# EAGLE schematic pcb v1 (EAGLE 7.4.0)
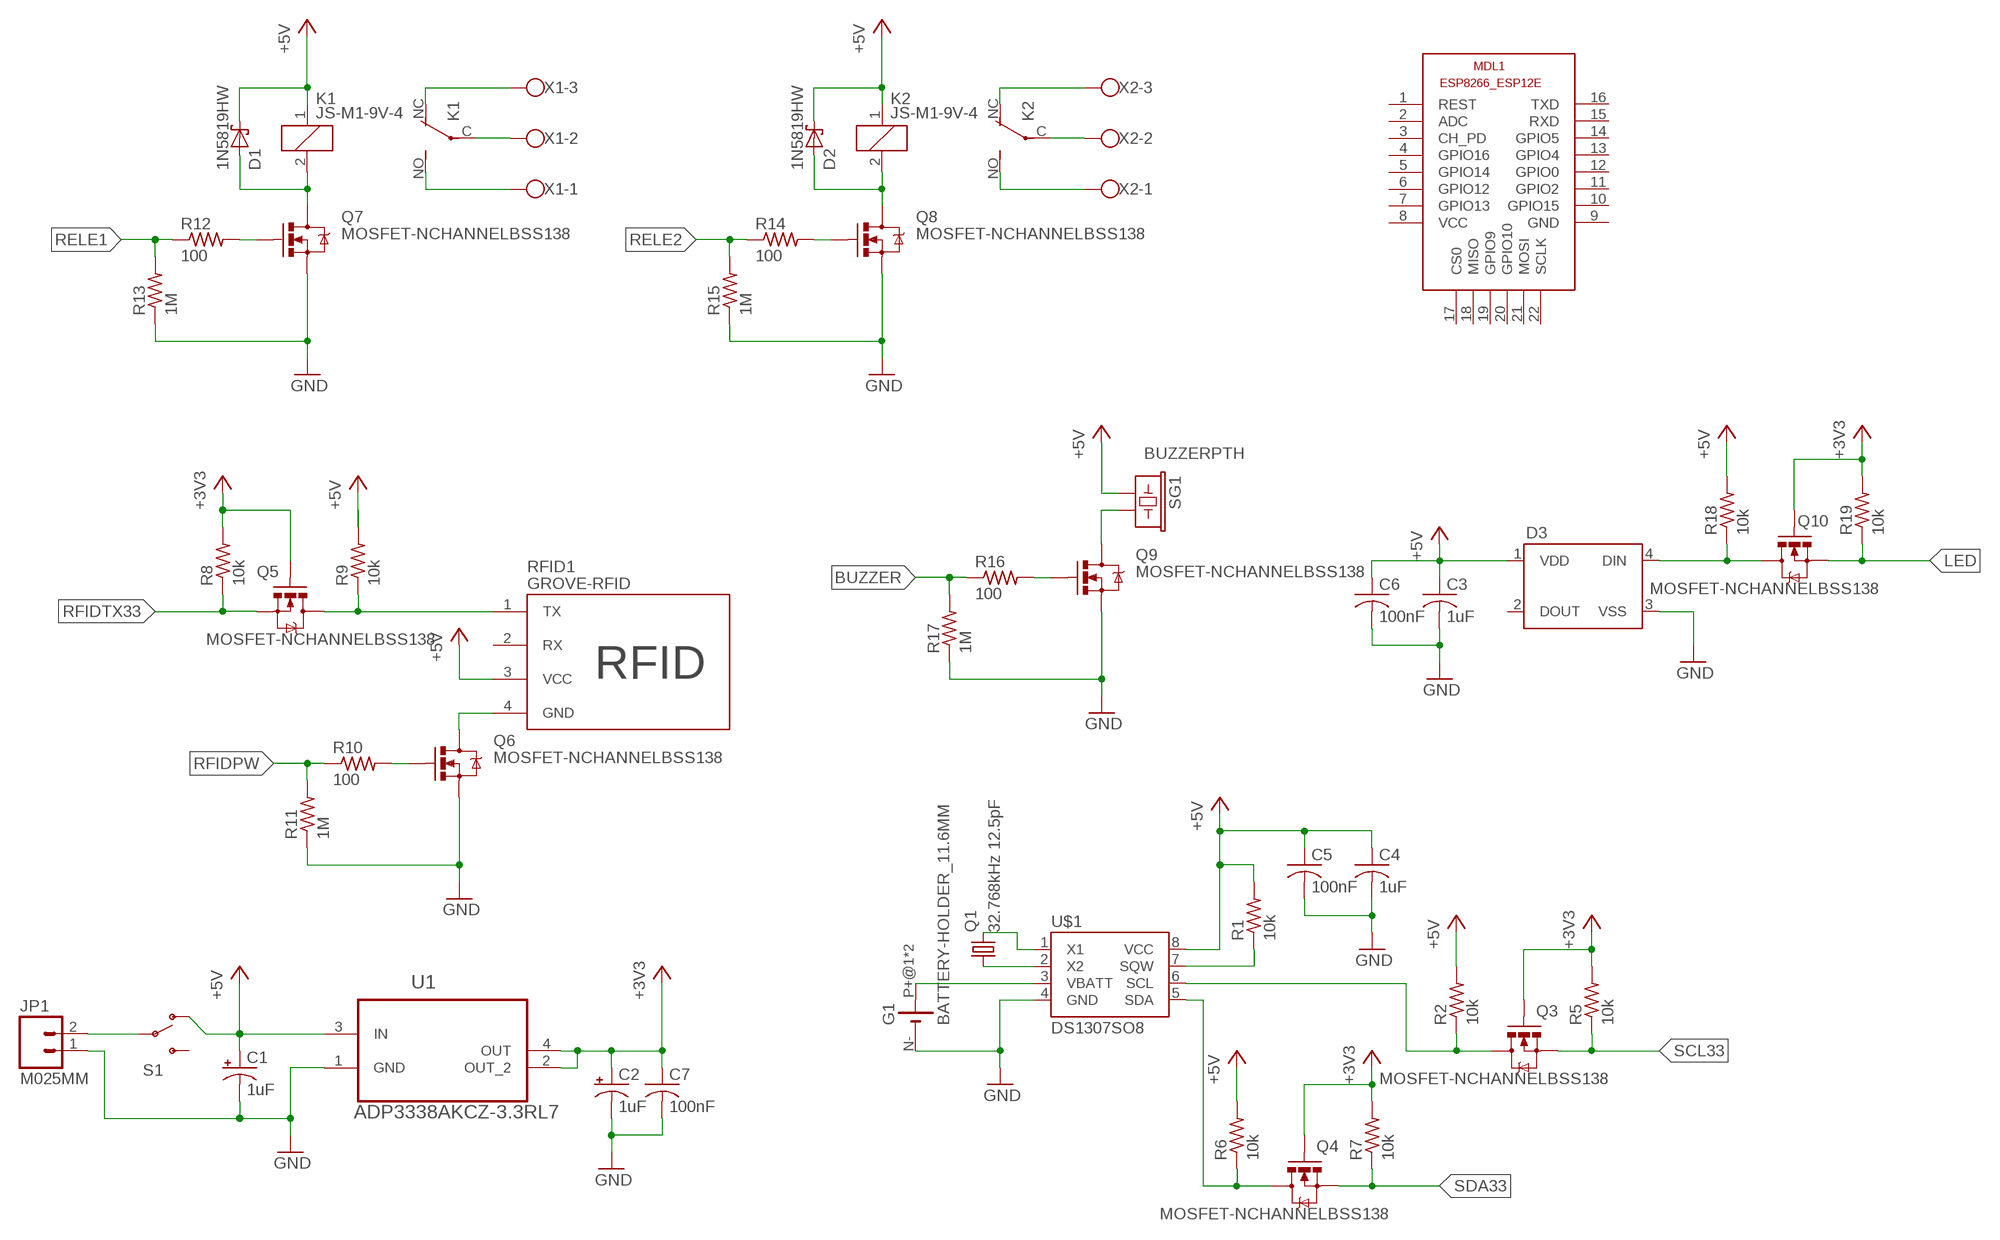
[diagram p0: schematic, sheet 1]

## Parts
C1  1uF  CPOL-US150CLZ-1010  [150CLZ-1010]
C2  1uF  CPOL-US150CLZ-1010  [150CLZ-1010]
C3  1uF  C-USC0805  [C0805]
C4  1uF  C-USC0805  [C0805]
C5  100nF  C-USC0805  [C0805]
C6  100nF  C-USC0805  [C0805]
C7  100nF  C-USC0805  [C0805]
D1  1N5819HW  [SOD-123]
D2  1N5819HW  [SOD-123]
D3  WS2812B  [WS2812B]
G1  BATTERY-HOLDER_11.6MM  [CELL_RETAINER_11.6MM]
JP1  M025MM  [SCREWTERMINAL-5MM-2]
K1  JS-M1-9V-4  [JS-M]
K2  JS-M1-9V-4  [JS-M]
MDL1  ESP8266-12EESP8266-ESP12E  [ESP8266-ESP12E]
Q1  32.768kHz 12.5pF  CRYSTALTC26H  [TC26H]
Q3  MOSFET-NCHANNELBSS138  [SOT23-3]
Q4  MOSFET-NCHANNELBSS138  [SOT23-3]
Q5  MOSFET-NCHANNELBSS138  [SOT23-3]
Q6  MOSFET-NCHANNELBSS138  [SOT23-3]
Q7  MOSFET-NCHANNELBSS138  [SOT23-3]
Q8  MOSFET-NCHANNELBSS138  [SOT23-3]
Q9  MOSFET-NCHANNELBSS138  [SOT23-3]
Q10  MOSFET-NCHANNELBSS138  [SOT23-3]
R1  10k  R-US_R0805  [R0805]
R2  10k  R-US_R0805  [R0805]
R5  10k  R-US_R0805  [R0805]
R6  10k  R-US_R0805  [R0805]
R7  10k  R-US_R0805  [R0805]
R8  10k  R-US_R0805  [R0805]
R9  10k  R-US_R0805  [R0805]
R10  100  R-US_R0805  [R0805]
R11  1M  R-US_R0805  [R0805]
R12  100  R-US_R0805  [R0805]
R13  1M  R-US_R0805  [R0805]
R14  100  R-US_R0805  [R0805]
R15  1M  R-US_R0805  [R0805]
R16  100  R-US_R0805  [R0805]
R17  1M  R-US_R0805  [R0805]
R18  10k  R-US_R0805  [R0805]
R19  10k  R-US_R0805  [R0805]
RFID1  GROVE-RFID  [GROVE-RFID]
S1  SWITCH-SPDTPTH  [SWITCH-SPDT]
SG1  BUZZERPTH  [BUZZER-12MM]
U1  ADP3338AKCZ-3.3RL7  [SOT230P700X180-4N]
U$1  DS1307SO8  [SO08]
X1  W237-103  [W237-103]
X2  W237-103  [W237-103]

## Nets
+3V3: C2.+ C7.1 Q3.1(G) Q4.1(G) Q5.1(G) Q10.1(G) R5.2 R7.2 R8.2 R19.2 U1.2(OUT_2) U1.4(OUT)
+5V: C1.+ C3.1 C4.1 C5.1 C6.1 D1.C D2.C D3.1(VDD) K1.1 K2.1 R1.2 R2.2 R6.2 R9.2 R18.2 RFID1.3(VCC) S1.1(O) SG1.+ U1.3(IN) U$1.8(VCC)
BUZZER: R16.1 R17.2
GND: C1.- C2.- C3.2 C4.2 C5.2 C6.2 C7.2 D3.3(VSS) G1.N-(-) JP1.1 Q6.2(S) Q7.2(S) Q8.2(S) Q9.2(S) R11.1 R13.1 R15.1 R17.1 U1.1(GND) U$1.4(GND)
LED: Q10.2(S) R19.1
N$1: JP1.2 S1.2(P)
N$2: Q1.2 U$1.1(X1)
N$3: Q1.1 U$1.2(X2)
N$4: G1.P+@1(+) G1.P+@2(+) U$1.3(VBATT)
N$5: Q3.3(D) R2.1 U$1.6(SCL)
N$6: R1.1 U$1.7(SQW)
N$7: Q6.3(D) RFID1.4(GND)
N$9: Q4.3(D) R6.1 U$1.5(SDA)
N$11: Q5.3(D) R9.1 RFID1.1(TX)
N$12: D1.A K1.2 Q7.3(D)
N$13: Q6.1(G) R10.2
N$14: Q7.1(G) R12.2
N$15: K1.NC(2:O) X1.3
N$16: K1.C(2:P) X1.2
N$17: K1.NO(2:S) X1.1
N$18: D2.A K2.2 Q8.3(D)
N$19: Q8.1(G) R14.2
N$20: K2.NC(2:O) X2.3
N$21: K2.C(2:P) X2.2
N$22: K2.NO(2:S) X2.1
N$23: Q9.1(G) R16.2
N$24: Q9.3(D) SG1.-
N$26: D3.4(DIN) Q10.3(D) R18.1
RELE1: R12.1 R13.2
RELE2: R14.1 R15.2
RFIDPW: R10.1 R11.2
RFIDTX33: Q5.2(S) R8.1
SCL33: Q3.2(S) R5.1
SDA33: Q4.2(S) R7.1
Unconnected: D3.2(DOUT) MDL1.1(REST) MDL1.2(ADC) MDL1.3(CH_PD) MDL1.4(GPIO16) MDL1.5(GPIO14) MDL1.6(GPIO12) MDL1.7(GPIO13) MDL1.8(VCC) MDL1.9(GND) MDL1.10(GPIO15) MDL1.11(GPIO2) MDL1.12(GPIO0) MDL1.13(GPIO4) MDL1.14(GPIO5) MDL1.15(RXD) MDL1.16(TXD) MDL1.17(CS0) MDL1.18(MISO) MDL1.19(GPIO9) MDL1.20(GPIO10) MDL1.21(MOSI) MDL1.22(SCLK) RFID1.2(RX) S1.3(S)

## Library data of the parts
C1 C2 = rcl:CPOL-US: POLARIZED CAPACITOR, American symbol
C3-C7 = rcl:C-US: CAPACITOR, American symbol
D1 D2 = diego:1N5819HW: 1N5819HW 1.0A SURFACE MOUNT SCHOTTKY BARRIER RECTIFIER
D3 = SparkFun-LED:WS2812B: WS2812B - Intelligent control LED integrated light source Technical Specifications: Power Supply Voltage (VDD): 3.5 to 5.3 V Input Voltage (VI): -0.5 to VDD+0.5 V Operating Junction Temperature (Topt): -25°C to +80°C Storage Temperature Range (Tstg): -55°C to +150°C
G1 = battery:BATTERY-HOLDER_11.6MM: 11.6mm PC BUTTON CELL RETAINER, high 5.97mm KEYSTONE ELECTRONICS CORP. Data sheet <http://www.farnell.com/cad/1718310.pdf>; MF: KEYSTONE; MPN: 2997; OC_FARNELL: 2293265
JP1 = SparkFun-Connectors:M02: Standard 2-pin 0.1" header. Use with - straight break away headers ( PRT-00116) - right angle break away headers (PRT-00553) - swiss pins (PRT-00743) - machine pins (PRT-00117) - female headers (PRT-00115) Molex polarized connector foot print use with: PRT-08233 with associated crimp pins and housings. 2.54_SCREWTERM for use with PRT-10571. 3.5mm Screw Terminal footprints for PRT-08084 5mm Screw Terminal footprints for use with PRT-08432; STOREFRONT_ID: PRT-08432
K1 K2 = relay:JS-M1*: Automotive Ultra-Miniature Power Relay NAiS Source: http://www.mew-europe.com/.. en_ds_61211_0000.pdf; OC_FARNELL: unknown; OC_NEWARK: unknown
MDL1 = ESP8266-ESP12E:ESP8266-12E: ESP8266-12E with additional I/O and GPIO04/05 corrected The author cannot warrant that this library is free from error or will meet your specific requirements. Created by PuceBaboon.com. Komagane, Nagano, JAPAN
Q1 = crystal:CRYSTAL: CRYSTAL; OC_FARNELL: unknown; OC_NEWARK: unknown
Q3-Q10 = SparkFun-DiscreteSemi:MOSFET-NCHANNEL: Common NMOSFET Parts MFG P/N Store ID Prod ID FDD8780 TRANS-09984 SI7820DN TRANS-11055 FDS6630A IC-08089 2N7002PW TRANS-11151 FQP30N06L COM-10213 TRANS-10060 BSS123LT1G TRANS-08345 BSS138 TRANS-00830 BS170 2N7000; PROD_ID: TRANS-00830
R1 R2 R5-R19 = rcl:R-US_: RESISTOR, American symbol
RFID1 = partes:GROVE-RFID
S1 = SparkFun-Electromechanical:SWITCH-SPDT: SPDT Switch Simple slide switch, Spark Fun Electronics SKU : COM-00102 DPDT SMT slide switch, AYZ0202, SWCH-08179; PROD_ID: SWCH-08261
SG1 = SparkFun-Electromechanical:BUZZER: Buzzer 12mm Spark Fun Electronics SKU : Comp-Buzzer
U1 = ADI-Phase-2:ADP3338AKCZ-3.3RL7: Low Dropout Regulator; MPN: ADP3338AKCZ-3.3RL7; OC_FARNELL: 1319313; OC_NEWARK: 19M8720; PACKAGE: SOT-223-3; SUPPLIER: Analog Devices
U$1 = SparkFun-FreqCtrl:DS1307: I2C real-time clock with battery backup.
X1 X2 = con-wago-500:W237-103: WAGO SCREW CLAMP; MPN: 237-103; OC_FARNELL: unknown; OC_NEWARK: 18M7116